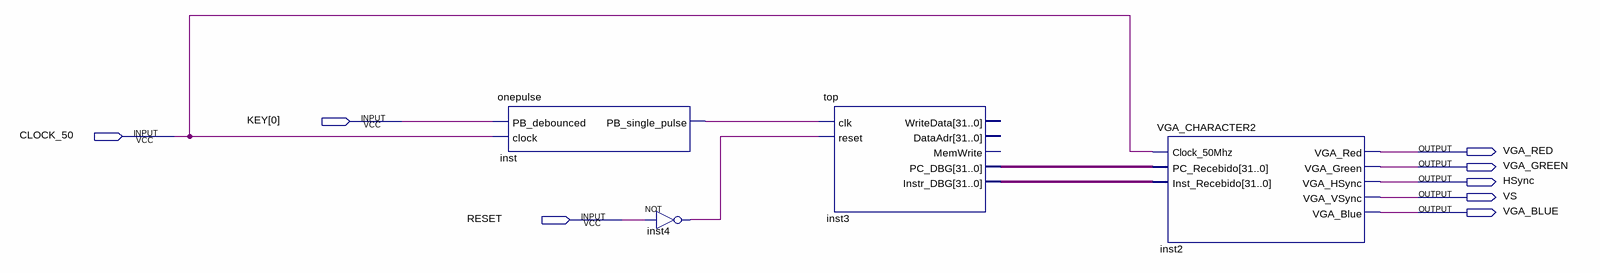
[diagram p0: schematic sheet]
// Quartus schematic BlocoPlaca.bdf as structural Verilog: 4 symbols, 8 pins
module BlocoPlaca (
  input  [0:0] KEY,
  input  CLOCK_50,
  input  RESET,
  output VGA_RED,
  output VGA_GREEN,
  output HSync,
  output VS,
  output VGA_BLUE
);

  wire inst4_out, inst_pb_single_pulse;
  wire [31:0] inst3_instr_dbg, inst3_pc_dbg;

  onepulse inst (.PB_debounced(KEY[0]), .clock(CLOCK_50), .PB_single_pulse(inst_pb_single_pulse));
  not inst4 (inst4_out, RESET);
  top inst3 (
    .clk(inst_pb_single_pulse), .reset(inst4_out), .PC_DBG(inst3_pc_dbg), .Instr_DBG(inst3_instr_dbg));  // open: WriteData, DataAdr, MemWrite
  VGA_CHARACTER2 inst2 (
    .Clock_50Mhz(CLOCK_50), .PC_Recebido(inst3_pc_dbg), .Inst_Recebido(inst3_instr_dbg), .VGA_Red(VGA_RED),
    .VGA_Green(VGA_GREEN), .VGA_HSync(HSync), .VGA_VSync(VS), .VGA_Blue(VGA_BLUE));
endmodule
